# EAGLE design MAX3232_Breakout_v11 (EAGLE 6.6.0)
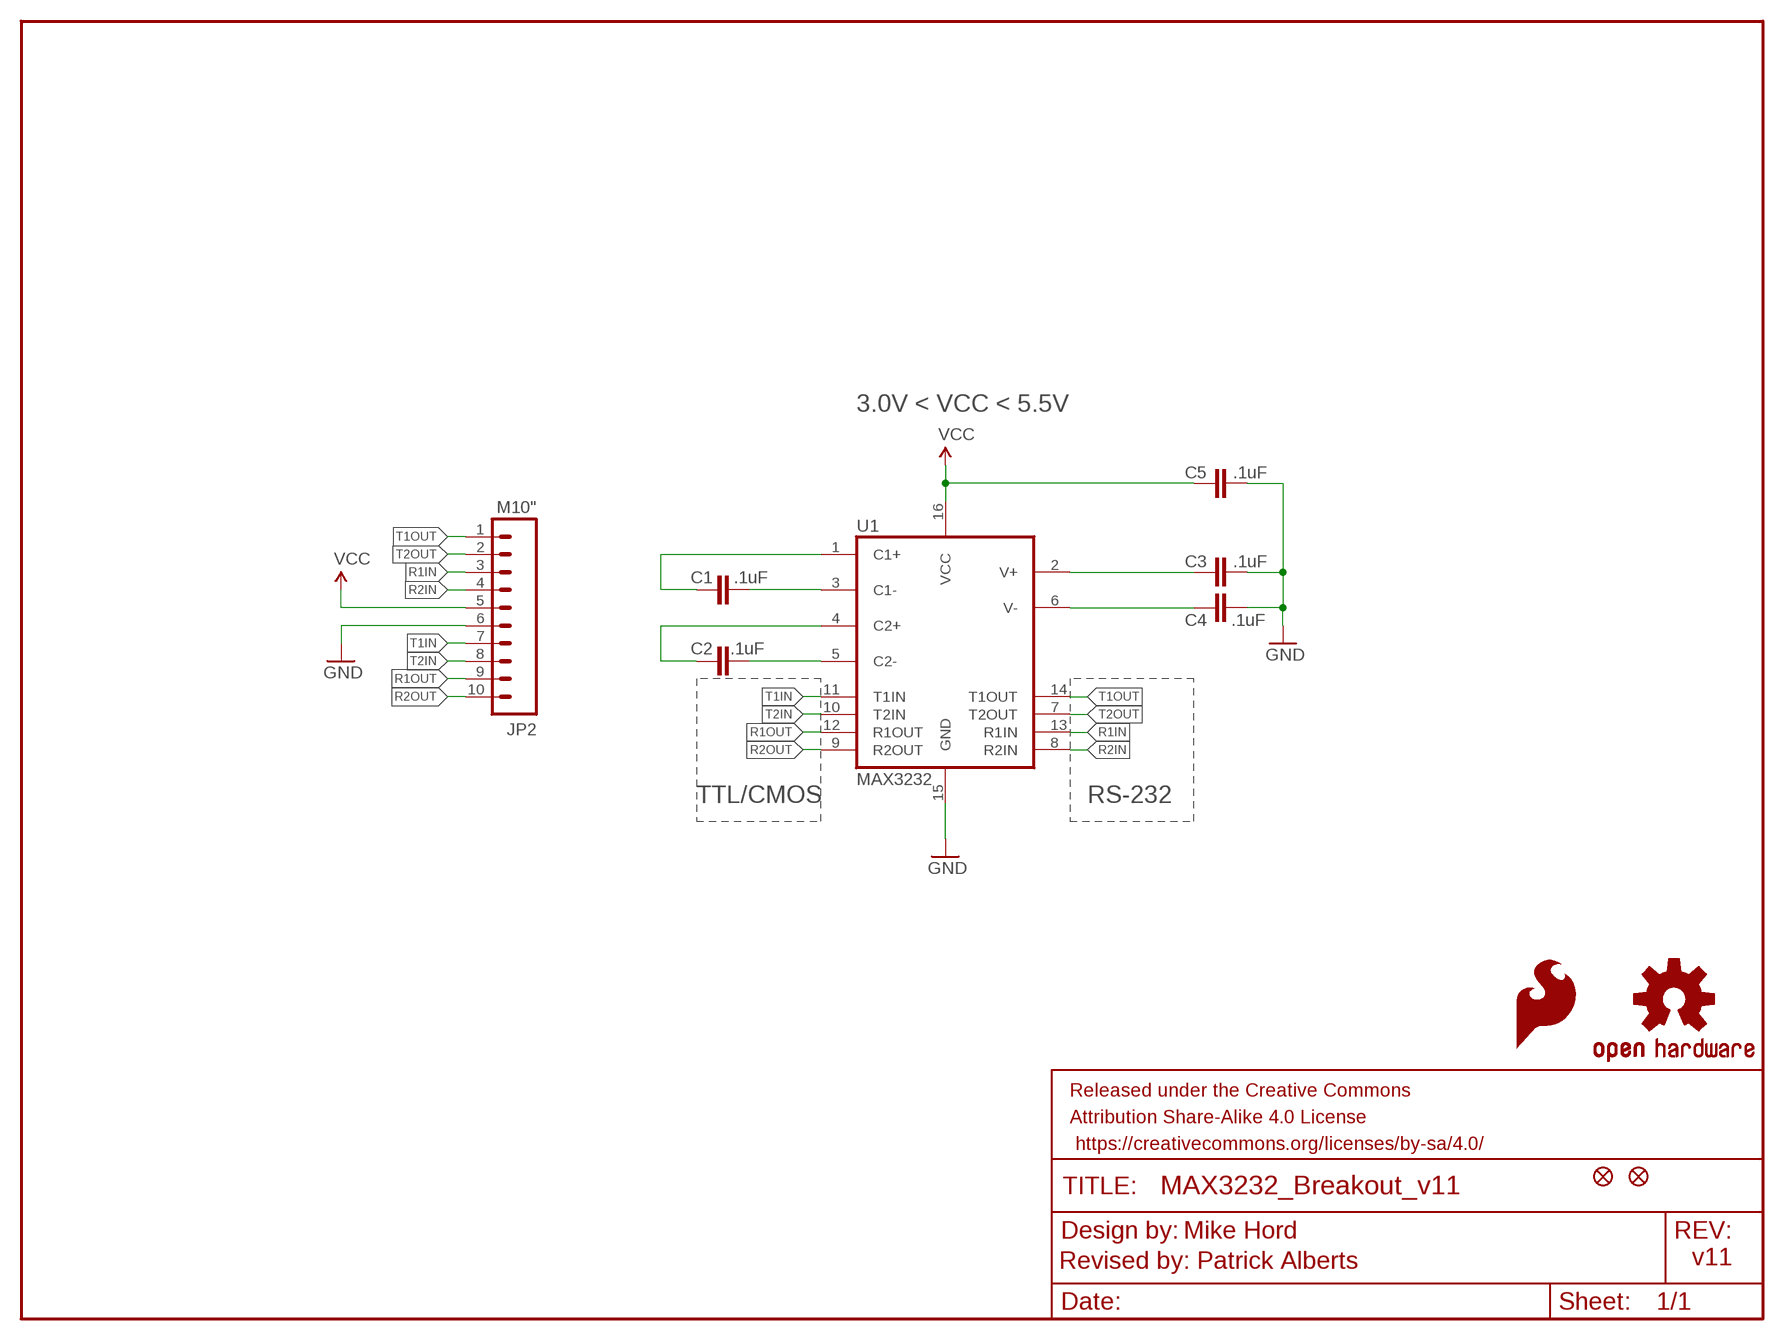
[diagram p0: schematic, sheet 1]

## Parts
C1  .1uF  0.1UF-25V(+80/-20%)(0603)  [0603-CAP]
C2  .1uF  0.1UF-25V(+80/-20%)(0603)  [0603-CAP]
C3  .1uF  0.1UF-25V(+80/-20%)(0603)  [0603-CAP]
C4  .1uF  0.1UF-25V(+80/-20%)(0603)  [0603-CAP]
C5  .1uF  0.1UF-25V(+80/-20%)(0603)  [0603-CAP]
FID1  FIDUCIAL1X2  [FIDUCIAL-1X2]
FID2  FIDUCIAL1X2  [FIDUCIAL-1X2]
FRAME1  FRAME-LETTER  [CREATIVE_COMMONS]
JP2  M10"  [1X10]
LOGO1  SFE_LOGO_FLAME.1_INCH  [SFE_LOGO_FLAME_.1]
U1  MAX3232  MAX232SOIC16  [SO016]
U$1  OSHW-LOGOS  [OSHW-LOGO-S]

## Nets
C1+: C1.1 U1.1(C1+)
C1-: C1.2 U1.3(C1-)
C2+: C2.1 U1.4(C2+)
C2-: C2.2 U1.5(C2-)
GND: C3.2 C4.2 C5.2 JP2.6 U1.15(GND)
R1IN: JP2.3 U1.13(R1IN)
R1OUT: JP2.9 U1.12(R1OUT)
R2IN: JP2.4 U1.8(R2IN)
R2OUT: JP2.10 U1.9(R2OUT)
T1IN: JP2.7 U1.11(T1IN)
T1OUT: JP2.1 U1.14(T1OUT)
T2IN: JP2.8 U1.10(T2IN)
T2OUT: JP2.2 U1.7(T2OUT)
V+: C3.1 U1.2(V+)
V-: C4.1 U1.6(V-)
VCC: C5.1 JP2.5 U1.16(VCC)

## Notes on the sheet
- 3.0V < VCC < 5.5V
- TTL/CMOS | RS-232
- Mike Hord
- Revised by: Patrick Alberts | v11

## Library data of the parts
C1-C5 = SparkFun-Capacitors:0.1UF-25V(+80/-20%)(0603): CAP-00810 Ceramic Standard decoupling cap; PROD_ID: CAP-00810; SPARKLE_ID: 918; VALUE: 0.1uF
FID1 FID2 = SparkFun-Aesthetics:FIDUCIAL: Fiducial Alignment Points Various fiducial points for machine vision alignment.
FRAME1 = SparkFun-Aesthetics:FRAME-LETTER: Schematic Frame Standard 8.5x11 US Letter frame; DESIGNER: NAME; NO_PART: 1; VERSION: v01
JP2 = SparkFun-Connectors:M10: Header 10 Standard 10-pin 0.1" header. Use with straight break away headers (SKU : PRT-00116), right angle break away headers (PRT-00553), swiss pins (PRT-00743), machine pins (PRT-00117), and female headers (PRT-00115).; NO_PART: 1
LOGO1 = SparkFun-Aesthetics:SFE_LOGO_FLAME: SFE Logo, flame only This is the SparkFun flame logo. The logo on the schematic will always be the same size; the package variant is the height of the flame. Default layer for the logo on the board is tSilk.
U1 = SparkFun-DigitalIC:MAX232: RS232 Transceiver Very common IC. This is generically called 'MAX232', but works with the 3V equivalent MAX3232 generic ICs. Field tested and mother approved. Spark Fun Electronics SKU : COM-00316 (DIP) and COM-00589 (SMD); PROD_ID: IC-08171
U$1 = SparkFun-Aesthetics:OSHW-LOGO: Open Source Hardware Logo This logo indicates the piece of hardware it is found on incorporates a OSHW license and/or adheres to the definition of open source hardware found here: http://freedomdefined.org/OSHW; NO_PART: 1

## Board
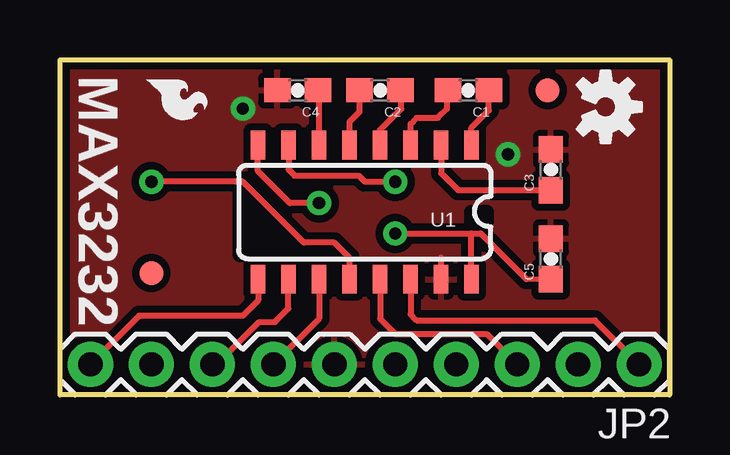
[diagram p1: board, top side]
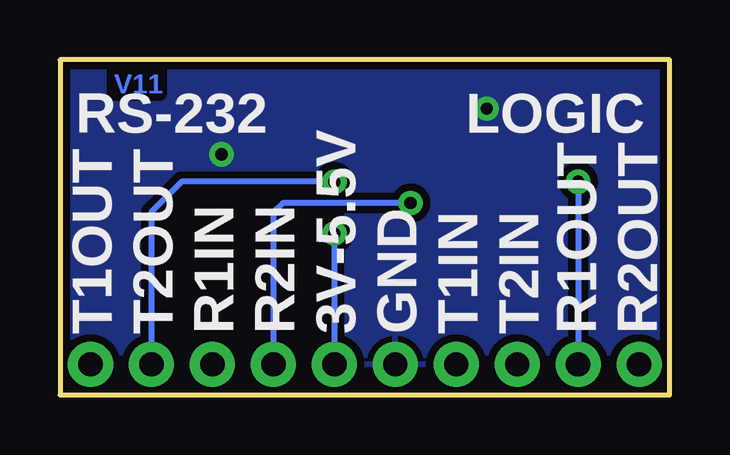
[diagram p2: board, bottom side, seen from below]

Size 25.4 x 13.97 mm. Coordinates in mm from the lower left corner, seen from the top.
Outline: 0,0 0,13.97 25.4,13.97 25.4,0 0,0
Copper layers (1*16): Top 0.035mm / dielectric 1.5mm / Bottom 0.035mm
Design rules "SparkFun-2-layer": minimum track width 7mil, minimum drill 15mil, track to track 8mil, track to pad 8mil, pad to pad 8mil, via to via 8mil, smd to smd 8mil, copper to edge 8mil, drill to drill 8mil, minimum pad ring 12mil, minimum via ring 10mil, stop-mask expansion 4mil, vias tented up to drill 20mil, thermal gap 10mil
tRestrict: area 17.1,7.2 to 17.8,7.6; area 7.5,5.8 to 7.6,8.5

### Footprints (pad centres in the part's own frame; a part is rotated, then mirrored left to right if it is on the bottom)
0603-CAP = smd 1.1 x 1: 1 -0.85,0; 2 0.85,0
FIDUCIAL-1X2 = smd 1 x 1: 1 0,0
1X10 = drill 1.016 pad 1.88: 1 0,0; 2 2.54,0; 3 5.08,0; 4 7.62,0; 5 10.16,0; 6 12.7,0; 7 15.24,0; 8 17.78,0; 9 20.32,0; 10 22.86,0
SO016 = smd 0.6 x 1.2: 1 -4.445,-2.8; 2 -3.175,-2.8; 3 -1.905,-2.8; 4 -0.635,-2.8; 5 0.635,-2.8; 6 1.905,-2.8; 7 3.175,-2.8; 8 4.445,-2.8; 9 4.445,2.8; 10 3.175,2.8; 11 1.905,2.8; 12 0.635,2.8; 13 -0.635,2.8; 14 -1.905,2.8; 15 -3.175,2.8; 16 -4.445,2.8

### Placement (x,y rotation side)
C1  17.02,12.7 180 top
C2  13.34,12.7 180 top
C3  20.45,9.39 90 top
C4  9.91,12.7 180 top
C5  20.45,5.67 90 top
FID1  3.81,5.08 0 top
FID2  20.32,12.7 0 top
FRAME1  -12.7,-13.97 0 top  (outside the outline)
JP2  24.13,1.27 180 top
LOGO1  3.24,13.46 270 top
U1  12.7,7.62 180 top
U$1  22.73,12.01 270 top

### Tracks (layer width: path | path; a pad name or v marks a point on that pad's centre or on a via)
C1+
  Top 0.254: U1.1 17.14,11.14 17.87,11.87 C1.1
C1-
  Top 0.254: U1.3 14.61,11.3 14.86,11.56 15.75,11.56 16.13,11.94 16.13,12.66 C1.2
C2+
  Top 0.254: U1.4 13.33,11.05 14.22,11.94 14.22,12.66 C2.1
C2-
  Top 0.254: U1.5 12.06,11.39 12.48,11.81 C2.2
GND  (via drill 0.51)
  Top 0.254: U1.15 15.88,5.71
  other vias: 18.67,10.03 7.62,11.94
  pour Top (isolate 0.305): 0,13.97 25.4,13.97 25.4,0 0,0
  pour Bottom (isolate 0.305): 0,13.97 25.4,13.97 25.4,0 0,0
R1IN
  Top 0.254: U1.13 13.34,3.17 13.97,2.54 17.78,2.54 JP2.3
R1OUT  (via drill 0.51)
  Top 0.254: U1.12 12.06,5.71 11.43,6.35 10.16,6.35 7.62,8.89 v3.81,8.89
  Bottom 0.254: v3.81,8.89 JP2.9
R2IN  (via drill 0.51)
  Top 0.254: v10.79,8 9.58,8 8.25,9.33 U1.8
  Bottom 0.254: v10.79,8 16.13,8 16.51,7.62 JP2.4
R2OUT
  Top 0.254: U1.9 8.26,3.94 7.62,3.3 3.3,3.3 JP2.10
T1IN
  Top 0.254: U1.11 10.79,3.17 JP2.7
T1OUT
  Top 0.254: U1.14 14.61,3.36 14.85,3.11 22.29,3.11 JP2.1
T2IN
  Top 0.254: JP2.8 6.54,1.27 8.31,3.04 8.95,3.04 9.51,3.6 9.51,4.81 U1.10
T2OUT  (via drill 0.51)
  Top 0.254: U1.7 9.53,9.4 9.78,9.14 12.45,9.14 12.7,8.89 v13.97,8.89
  Bottom 0.254: v13.97,8.89 20.32,8.89 21.59,7.62 JP2.2
V+
  Top 0.254: U1.2 15.88,9.25 16.58,8.54 C3.1
V-
  Top 0.254: U1.6 10.79,12.66 C4.1
VCC  (via drill 0.51)
  Top 0.203: 19.43,4.83 C5.1
  Top 0.254: v13.97,6.73 17.14,6.73 | 17.14,6.73 17.53,6.73 19.43,4.83 | C5.1 | U1.16 17.14,6.73
  Bottom 0.254: v13.97,6.73 JP2.5

### Text on the board
Bottom: V11
tPlace: MAX3232
bPlace: LOGIC | RS-232 | R2OUT | R1OUT | T2IN | T1IN | GND | 3V-5.5V | R2IN | R1IN | T2OUT | T1OUT
tValues: Mike Hord
tDocu: M Hord | Revised by:Patrick Alberts